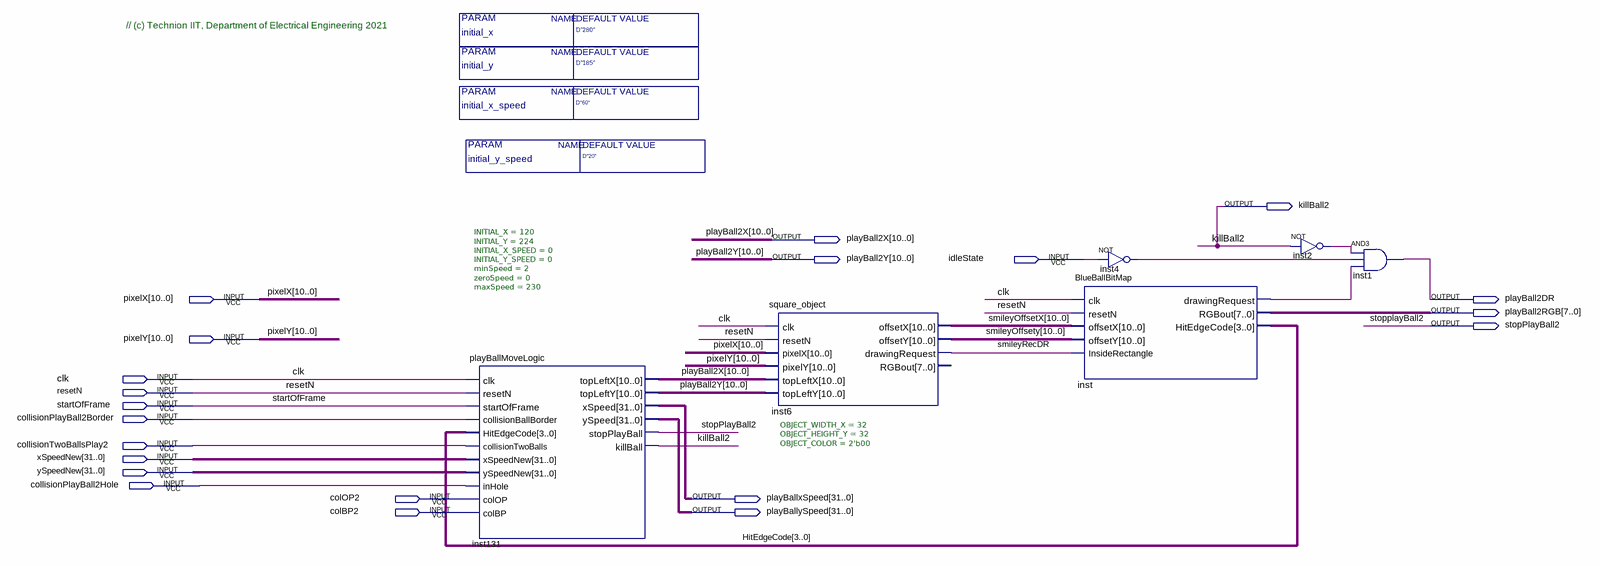
[diagram p0: schematic sheet]
// Quartus schematic playBall2Block.bdf as structural Verilog: 6 symbols, 21 pins
module playBall2Block #(parameter initial_x = "D\"280\"", parameter initial_y = "D\"185\"", parameter initial_x_speed = "D\"60\"", parameter initial_y_speed = "D\"20\"") (
  input  idleState,
  input  [10:0] pixelX,
  input  [10:0] pixelY,
  input  clk,
  input  resetN,
  input  startOfFrame,
  input  collisionPlayBall2Border,
  input  collisionTwoBallsPlay2,
  input  [31:0] xSpeedNew,
  input  [31:0] ySpeedNew,
  input  collisionPlayBall2Hole,
  input  colOP2,
  input  colBP2,
  output killBall2,
  output [10:0] playBall2X,
  output [10:0] playBall2Y,
  output playBall2DR,
  output [7:0] playBall2RGB,
  output stopPlayBall2,
  output [31:0] playBallxSpeed,
  output [31:0] playBallySpeed
);

  wire inst2_out, inst4_out, inst_drawingrequest, smileyRecDR;
  wire [3:0] HitEdgeCode;
  wire [10:0] smileyOffsetX, smileyOffsety;

  playBallMoveLogic #(.INITIAL_X(120), .INITIAL_Y(224), .INITIAL_X_SPEED(0), .INITIAL_Y_SPEED(0), .minSpeed(2), .zeroSpeed(0), .maxSpeed(230)) inst131 (
    .clk(clk), .resetN(resetN), .startOfFrame(startOfFrame), .collisionBallBorder(collisionPlayBall2Border),
    .HitEdgeCode(HitEdgeCode), .collisionTwoBalls(collisionTwoBallsPlay2), .xSpeedNew(xSpeedNew),
    .ySpeedNew(ySpeedNew), .inHole(collisionPlayBall2Hole), .colOP(colOP2), .colBP(colBP2),
    .topLeftX(playBall2X), .topLeftY(playBall2Y), .xSpeed(playBallxSpeed), .ySpeed(playBallySpeed),
    .stopPlayBall(stopPlayBall2), .killBall(killBall2));
  square_object #(.OBJECT_WIDTH_X(32), .OBJECT_HEIGHT_Y(32), .OBJECT_COLOR(2'b00)) inst6 (
    .clk(clk), .resetN(resetN), .pixelX(pixelX), .pixelY(pixelY), .topLeftX(playBall2X),
    .topLeftY(playBall2Y), .offsetX(smileyOffsetX), .offsetY(smileyOffsety), .drawingRequest(smileyRecDR));  // open: RGBout
  not inst4 (inst4_out, idleState);
  BlueBallBitMap inst (
    .clk(clk), .resetN(resetN), .offsetX(smileyOffsetX), .offsetY(smileyOffsety),
    .InsideRectangle(smileyRecDR), .drawingRequest(inst_drawingrequest), .RGBout(playBall2RGB),
    .HitEdgeCode(HitEdgeCode));
  not inst2 (inst2_out, killBall2);
  and inst1 (playBall2DR, inst2_out, inst4_out, inst_drawingrequest);

  // Notes on the sheet:
  //   // (c) Technion IIT, Department of Electrical Engineering 2021
endmodule
